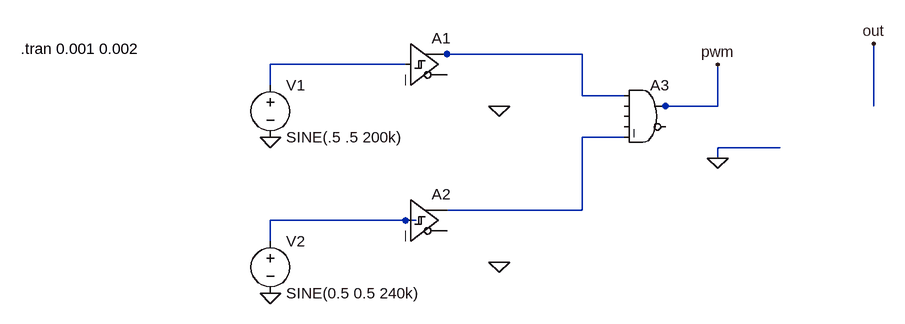
[diagram p0: schematic Draft1.asc]
Draft1.asc, the LTspice schematic file:
Version 4
SHEET 1 1236 680
WIRE 496 288 480 288
WIRE 704 288 496 288
WIRE 432 304 224 304
WIRE 224 336 224 304
WIRE 704 352 704 288
WIRE 768 352 704 352
WIRE 832 368 816 368
WIRE 912 368 912 304
WIRE 912 368 832 368
WIRE 1152 368 1152 272
WIRE 768 416 704 416
WIRE 1008 432 912 432
WIRE 912 448 912 432
WIRE 704 528 704 416
WIRE 704 528 496 528
WIRE 432 544 224 544
WIRE 448 544 432 544
WIRE 224 576 224 544
FLAG 224 416 0
FLAG 224 656 0
FLAG 576 368 0
FLAG 576 608 0
FLAG 912 448 0
FLAG 912 304 pwm
FLAG 1152 272 out
SYMBOL voltage 224 320 R0
SYMATTR InstName V1
SYMATTR Value SINE(.5 .5 200k)
SYMBOL voltage 224 560 R0
SYMATTR InstName V2
SYMATTR Value SINE(0.5 0.5 240k)
SYMBOL Digital/schmitt 432 240 R0
SYMATTR InstName A1
SYMBOL Digital/schmitt 432 480 R0
SYMATTR InstName A2
SYMBOL Digital/and 800 320 R0
SYMATTR InstName A3
TEXT -160 280 Left 2 !.tran 0.001 0.002

The netlist it stands for:
* Draft1.asc
V1 N002 0 SINE(.5 .5 200k)
V2 N004 0 SINE(0.5 0.5 240k)
A1 N002 0 0 0 0 0 N001 0 SCHMITT
A2 N004 0 0 0 0 0 N003 0 SCHMITT
A3 N001 0 0 0 N003 0 pwm 0 AND
.tran 0.001 0.002
.backanno
.end